# Altium schematic sheet Tegra_Serial.SchDoc
size A4
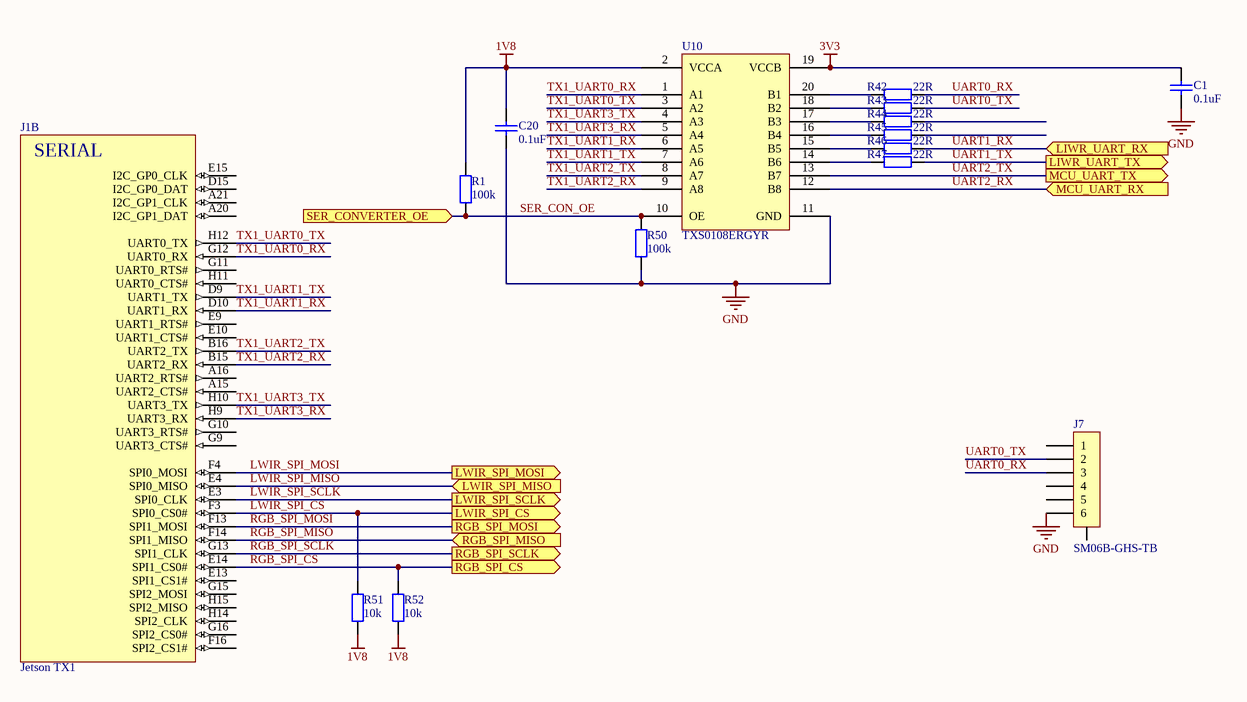
[diagram p0: Tegra_Serial.SchDoc]

## Parts
C1  Capacitance: 0.1uF  [0402C_M]  (hidden comment: GRM155R71C104KA88D)
C20  Capacitance: 0.1uF  [0402C_M]  (hidden comment: GRM155R71C104KA88D)
J1  Jetson TX1  [Nvidia Jetson TX1]  (part B of 14)
J7  SM06B-GHS-TB  [SM06B-GHS-TB]
R1  Resistance: 100k  [0402R_M]  (hidden comment: CRCW0402100KJNED)
R42  Resistance: 22R  [0402R_M]  (hidden comment: CRCW040222R0JNED)
R43  Resistance: 22R  [0402R_M]  (hidden comment: CRCW040222R0JNED)
R44  Resistance: 22R  [0402R_M]  (hidden comment: CRCW040222R0JNED)
R45  Resistance: 22R  [0402R_M]  (hidden comment: CRCW040222R0JNED)
R46  Resistance: 22R  [0402R_M]  (hidden comment: CRCW040222R0JNED)
R47  Resistance: 22R  [0402R_M]  (hidden comment: CRCW040222R0JNED)
R50  Resistance: 100k  [0402R_M]  (hidden comment: CRCW0402100KJNED)
R51  value 10k  [0402R_M]  (hidden comment: CRCW040210K0FKED)
R52  value 10k  [0402R_M]  (hidden comment: CRCW040210K0FKED)
U10  TXS0108ERGYR  [VQFN20]

## Ports
LIWR_UART_RX (in), LIWR_UART_TX (out), LWIR_SPI_CS (out), LWIR_SPI_MISO (in), LWIR_SPI_MOSI (out), LWIR_SPI_SCLK (out), MCU_UART_RX (in), MCU_UART_TX (out), RGB_SPI_CS (out), RGB_SPI_MISO (in), RGB_SPI_MOSI (out), RGB_SPI_SCLK (out), SER_CONVERTER_OE (in)

## Nets
1V8: C20.2 R1.2 R51.1 R52.1 U10.2(VCCA)
3V3: C1.2 U10.19(VCCB)
GND: C1.1 C20.1 J7.6 R50.1 U10.11(GND)
LWIR_SPI_CS: J1.F3(SPI0_CS0#) R51.2 ; port LWIR_SPI_CS
LWIR_SPI_MISO: J1.E4(SPI0_MISO) ; port LWIR_SPI_MISO
LWIR_SPI_MOSI: J1.F4(SPI0_MOSI) ; port LWIR_SPI_MOSI
LWIR_SPI_SCLK: J1.E3(SPI0_CLK) ; port LWIR_SPI_SCLK
RGB_SPI_CS: J1.E14(SPI1_CS0#) R52.2 ; port RGB_SPI_CS
RGB_SPI_MISO: J1.F14(SPI1_MISO) ; port RGB_SPI_MISO
RGB_SPI_MOSI: J1.F13(SPI1_MOSI) ; port RGB_SPI_MOSI
RGB_SPI_SCLK: J1.G13(SPI1_CLK) ; port RGB_SPI_SCLK
SER_CON_OE: R1.1 R50.2 U10.10(OE) ; port SER_CONVERTER_OE
TX1_UART0_RX: J1.G12(UART0_RX) U10.1(A1)
TX1_UART0_TX: J1.H12(UART0_TX) U10.3(A2)
TX1_UART1_RX: J1.D10(UART1_RX) U10.6(A5)
TX1_UART1_TX: J1.D9(UART1_TX) U10.7(A6)
TX1_UART2_RX: J1.B15(UART2_RX) U10.9(A8)
TX1_UART2_TX: J1.B16(UART2_TX) U10.8(A7)
TX1_UART3_RX: J1.H9(UART3_RX) U10.5(A4)
TX1_UART3_TX: J1.H10(UART3_TX) U10.4(A3)
UART0_RX: J7.3 R42.2
UART0_TX: J7.2 R43.2
UART1_RX: R46.2 ; port LIWR_UART_RX
UART1_TX: R47.2 ; port LIWR_UART_TX
UART2_RX: U10.12(B8) ; port MCU_UART_RX
UART2_TX: U10.13(B7) ; port MCU_UART_TX
NetR42_1: R42.1 U10.20(B1)
NetR43_1: R43.1 U10.18(B2)
NetR44_1: R44.1 U10.17(B3)
NetR45_1: R45.1 U10.16(B4)
NetR46_1: R46.1 U10.15(B5)
NetR47_1: R47.1 U10.14(B6)

Not connected (* = marked no-connect by the designer): J1 A15(UART2_CTS#) A16(UART2_RTS#) A20(I2C_GP1_DAT) A21(I2C_GP1_CLK) D15(I2C_GP0_DAT) E9(UART1_RTS#) E10(UART1_CTS#) E13(SPI1_CS1#) E15(I2C_GP0_CLK) F16(SPI2_CS1#) G9(UART3_CTS#) G10(UART3_RTS#) G11(UART0_RTS#) G15(SPI2_MOSI) G16(SPI2_CS0#) H11(UART0_CTS#) H14(SPI2_CLK) H15(SPI2_MISO); J7 0 1 4 5; R44 2; R45 2

## Notes on the sheet
- (in symbol NVIDIA_Jetson_TX1, part B) SERIAL

## Library data of the parts
C1 C20 = GRM155R71C104KA88D: CAP CER 0.1UF 16V X7R 0402; Manufacturer: Murata Electronics North America; Tolerance: ±10%; Supplier 1: Digi-Key; Manufacturer Part Number: GRM155R71C104KA88D; RoHS: RoHS Compliant; Category: Capacitors; Stock 1: 58190082; Pricing 1: 1=0.1, 10=0.013, 100=0.0059, 500=0.00422, 1000=0.00332, 2500=0.00302, 5000=0.00278 (USD); Packaging: Cut Tape (CT); Part Status: Active; Voltage - Rated: 16V; Temperature Coefficient: X7R; Operating Temperature: -55°C ~ 125°C; Features: -; Ratings: -; Applications: General Purpose; Mounting Type: Surface Mount, MLCC; Package / Case: 0402 (1005 Metric); Size / Dimension: 0.039" L x 0.020" W (1.00mm x 0.50mm); Height - Seated (Max): -; Thickness (Max): 0.022" (0.55mm); Lead Spacing: -; Lead Style: -; ComponentLink1URL: http://www.murata.com/~/media/webrenewal/support/library/catalog/products/capacitor/mlcc/c02e.ashx; ComponentLink1Description: http://www.murata.com/~/media/webrenewal/support/library/catalog/products/capacitor/mlcc/c02e.ashx; Supplier Part Number 1: 490-3261-1-ND
J1 = NVIDIA_Jetson_TX1: Nvidia computing module
J7 = SM06B-GHS-TB(LF)(SN): CONN HEADER GH SIDE 6POS 1.25MM; Manufacturer: JST Sales America Inc.; Pitch - Mating: 0.049" (1.25mm); Style: Board to Cable/Wire; Shrouding: Shrouded - 4 Wall; Number of Positions: 6; Number of Positions Loaded: All; Material Flammability Rating: UL94 V-0; Current Rating: 1A; Voltage Rating: 50V; Supplier 1: Digi-Key; Manufacturer Part Number: SM06B-GHS-TB(LF)(SN); RoHS: RoHS Compliant; Category: Connectors, Interconnects; Stock 1: 0; Pricing 1: 1=0.58, 10=0.545, 100=0.4175, 500=0.36302, 1000=0.2995 (USD); Packaging: Cut Tape (CT); Part Status: Active; Connector Type: Header; Contact Type: Outer Shroud Contact; Number of Rows: 1; Row Spacing - Mating: -; Mounting Type: Surface Mount, Right Angle; Termination: Solder; Fastening Type: Locking Ramp; Contact Length - Mating: -; Contact Length - Post: -; Overall Contact Length: -; Insulation Height: 0.167" (4.25mm); Contact Shape: Rectangular; Contact Finish - Mating: Tin; Contact Finish Thickness - Mating: -; Contact Finish - Post: Tin; Contact Material: Phosphor Bronze; Insulation Material: Polyamide (PA9T), Nylon 9T; Features: Solder Retention; Operating Temperature: -25°C ~ 85°C; Ingress Protection: -; Insulation Color: Natural; Mated Stacking Heights: -; Contact Finish Thickness - Post: -; Applications: -; ComponentLink1URL: http://www.jst-mfg.com/product/pdf/eng/eGH.pdf; ComponentLink1Description: http://www.jst-mfg.com/product/pdf/eng/eGH.pdf; Supplier Part Number 1: 455-1568-1-ND
R1 R50 = CRCW0402100KJNED: RES SMD 100K OHM 5% 1/16W 0402; Manufacturer: Vishay; Brand: Vishay / Dale; Power Rating: 63 mW; Temperature Coefficient: 200 PPM / K; Voltage Rating: 50 V; Unit Weight: 0.000023 oz; Supplier 1: Digi-Key; Manufacturer Part Number: CRCW0402100KJNED; Stock 1: 174; Pricing 1: 1=0.1, 10=0.025, 100=0.01, 1000=0.0045, 2500=0.0039, 5000=0.0032 (USD); Product Category: Thick Film Resistors - SMD; RoHS: Details; Tolerance: 5 %; Case Code - in: 0402; Case Code - mm: 1005; Operating Temperature Range: - 55 C to + 155 C; Series: CRCW; Height: 0.35 mm; Length: 1 mm; Package / Case: 0402 (1005 metric); Packaging: Reel; Product: Thick Film Resistors SMD; Factory Pack Quantity: 10000; Termination Style: SMD/SMT; Width: 0.5 mm; ComponentLink1URL: https://datasheet.ciiva.com/3255/dcrcwe3-3255949.pdf; ComponentLink1Description: https://datasheet.ciiva.com/3255/dcrcwe3-3255949.pdf; ComponentLink2URL: https://datasheet.ciiva.com/28420/dcrcwe3-28420124.pdf; ComponentLink2Description: https://datasheet.ciiva.com/28420/dcrcwe3-28420124.pdf; ComponentLink3URL: https://datasheet.ciiva.com/3255/dcrcwe3-3255950.pdf; ComponentLink3Description: https://datasheet.ciiva.com/3255/dcrcwe3-3255950.pdf; ComponentLink4URL: https://datasheet.ciiva.com/28621/1847332-28621326.pdf; ComponentLink4Description: https://datasheet.ciiva.com/28621/1847332-28621326.pdf; ComponentLink5URL: https://datasheet.ciiva.com/16763/70201119-16763038.pdf; ComponentLink5Description: https://datasheet.ciiva.com/16763/70201119-16763038.pdf; ComponentLink6URL: https://datasheet.ciiva.com/2461/dcrcwe3-2461990.pdf; ComponentLink6Description: https://datasheet.ciiva.com/2461/dcrcwe3-2461990.pdf; ComponentLink7URL: https://datasheet.ciiva.com/2461/dcrcwe3-2461989.pdf; ComponentLink7Description: https://datasheet.ciiva.com/2461/dcrcwe3-2461989.pdf; ComponentLink8URL: https://datasheet.ciiva.com/2461/dcrcwe3-2461991.pdf; ComponentLink8Description: https://datasheet.ciiva.com/2461/dcrcwe3-2461991.pdf; ComponentLink9URL: https://datasheet.ciiva.com/7777/1533075-7777191.pdf; ComponentLink9Description: https://datasheet.ciiva.com/7777/1533075-7777191.pdf; ComponentLink10URL: https://datasheet.ciiva.com/5552/dcrcwe3-109170-5552439.pdf; ComponentLink10Description: https://datasheet.ciiva.com/5552/dcrcwe3-109170-5552439.pdf; Supplier Part Number 1: 541-100KJDKR-ND
R42-R47 = CRCW040222R0JNED: RES SMD 22 OHM 5% 1/16W 0402; Manufacturer: Vishay / Dale; Power Rating: 63 mW; Temperature Coefficient: 200 PPM / K; Voltage Rating: 50 V; Unit Weight: 0.000023 oz; Supplier 1: Digi-Key; Manufacturer Part Number: CRCW040222R0JNED; Stock 1: 238592; Pricing 1: 1=0.1, 10=0.025, 100=0.01, 1000=0.0045, 2500=0.0039, 5000=0.0032 (USD); Product Category: Thick Film Resistors - SMD; RoHS: Details; Brand: Vishay / Dale; Tolerance: 5 %; Case Code - in: 0402; Case Code - mm: 1005; Operating Temperature Range: - 55 C to + 155 C; Series: CRCW; Height: 0.35 mm; Length: 1 mm; Package / Case: 0402 (1005 metric); Packaging: Reel; Product: Thick Film Resistors SMD; Factory Pack Quantity: 10000; Termination Style: SMD/SMT; Width: 0.5 mm; ComponentLink1URL: https://datasheet.ciiva.com/16429/dcrcwe3-16429946.pdf; ComponentLink1Description: https://datasheet.ciiva.com/16429/dcrcwe3-16429946.pdf; ComponentLink2URL: https://datasheet.ciiva.com/8882/dcrcwe3-8882922.pdf; ComponentLink2Description: https://datasheet.ciiva.com/8882/dcrcwe3-8882922.pdf; ComponentLink3URL: https://datasheet.ciiva.com/16770/70201119-16770509.pdf; ComponentLink3Description: https://datasheet.ciiva.com/16770/70201119-16770509.pdf; ComponentLink4URL: https://datasheet.ciiva.com/3256/dcrcwe3-3256251.pdf; ComponentLink4Description: https://datasheet.ciiva.com/3256/dcrcwe3-3256251.pdf; ComponentLink5URL: https://datasheet.ciiva.com/2462/dcrcwe3-2462055.pdf; ComponentLink5Description: https://datasheet.ciiva.com/2462/dcrcwe3-2462055.pdf; ComponentLink6URL: https://datasheet.ciiva.com/7743/dcrcwe3-7743525.pdf; ComponentLink6Description: https://datasheet.ciiva.com/7743/dcrcwe3-7743525.pdf; ComponentLink7URL: https://datasheet.ciiva.com/2462/dcrcwe3-2462057.pdf; ComponentLink7Description: https://datasheet.ciiva.com/2462/dcrcwe3-2462057.pdf; ComponentLink8URL: https://datasheet.ciiva.com/2462/dcrcwe3-2462056.pdf; ComponentLink8Description: https://datasheet.ciiva.com/2462/dcrcwe3-2462056.pdf; Supplier Part Number 1: 541-22JCT-ND
R51 R52 = CRCW040210K0FKED: RES SMD 10K OHM 1% 1/16W 0402; Manufacturer: Vishay Dale; Power (Watts): 0.063W, 1/16W; Temperature Coefficient: ±100ppm/°C; Supplier 1: Digi-Key; Manufacturer Part Number: CRCW040210K0FKED; RoHS: RoHS Compliant; Category: Resistors; Stock 1: 0; Pricing 1: 1=0.1, 10=0.037, 100=0.0149, 1000=0.0067, 2500=0.00582, 5000=0.00481 (USD); Packaging: Cut Tape (CT); Part Status: Active; Tolerance: ±1%; Composition: Thick Film; Features: Automotive AEC-Q200; Operating Temperature: -55°C ~ 155°C; Package / Case: 0402 (1005 Metric); Supplier Device Package: 0402; Size / Dimension: 0.039" L x 0.020" W (1.00mm x 0.50mm); Height - Seated (Max): 0.016" (0.40mm); Failure Rate: -; ComponentLink1URL: http://www.vishay.com/docs/20035/dcrcwe3.pdf; ComponentLink1Description: http://www.vishay.com/docs/20035/dcrcwe3.pdf; Supplier Part Number 1: 541-10.0KLCT-ND
U10 = TXS0108ERGYR: IC XLATR VOLT-LVL 8B BDIR 20QFN; Manufacturer: Texas Instruments; Translator Type: Voltage Level; Channel Type: Bidirectional; Number of Circuits: 1; Channels per Circuit: 8; Voltage - VCCA: 1.2 V ~ 3.6 V; Voltage - VCCB: 1.65 V ~ 5.5 V; Output Type: Open Drain, Push-Pull; Data Rate: 60Mbps; Supplier 1: Digi-Key; Manufacturer Part Number: TXS0108ERGYR; RoHS: RoHS Compliant; Category: Integrated Circuits (ICs); Stock 1: 47447; Pricing 1: 1=1.87, 10=1.676, 100=1.3471, 500=1.10674, 1000=0.91701 (USD); Packaging: Cut Tape (CT); Part Status: Active; Input Signal: -; Output Signal: -; Operating Temperature: -40°C ~ 85°C (TA); Features: Auto-Direction Sensing; Mounting Type: Surface Mount; Package / Case: 20-VFQFN Exposed Pad; Supplier Device Package: 20-VQFN (3.5x4.5); ComponentLink1URL: http://www.ti.com/lit/ds/symlink/txs0108e.pdf; ComponentLink1Description: http://www.ti.com/lit/ds/symlink/txs0108e.pdf; Supplier Part Number 1: 296-24806-1-ND